# EAGLE design board (EAGLE 8.2.0)
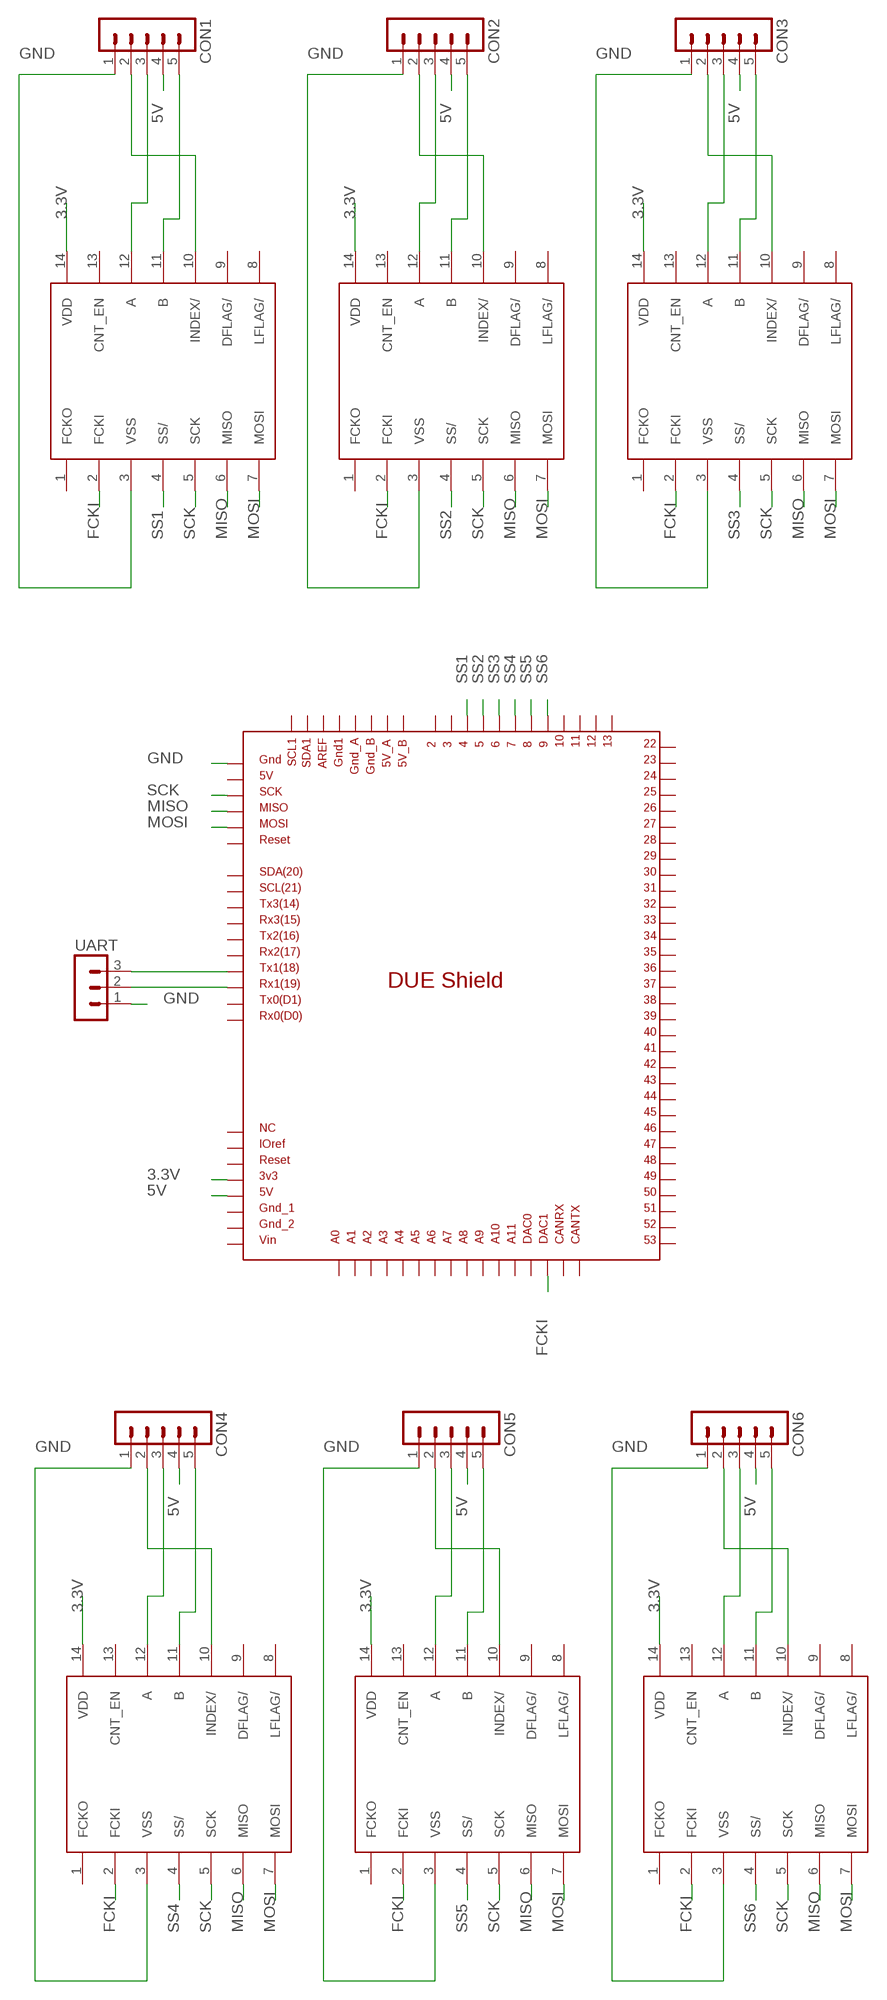
[diagram p0: schematic, sheet 1]

## Parts
CON1  MA05-1  [MA05-1]
CON2  MA05-1  [MA05-1]
CON3  MA05-1  [MA05-1]
CON4  MA05-1(BOTTOM)  [MA05-1(BOTTOM)]
CON5  MA05-1(BOTTOM)  [MA05-1(BOTTOM)]
CON6  MA05-1(BOTTOM)  [MA05-1(BOTTOM)]
IC1  LFLS7366R  [SO14]
IC2  LFLS7366R  [SO14]
IC3  LFLS7366R  [SO14]
IC4  LFLS7366R  [SO14]
IC5  LFLS7366R  [SO14]
IC6  LFLS7366R  [SO14]
U$1  DUE(ENCODER)  [DUE(ENCODER)]
UART  MA03-1  [MA03-1]

## Nets
3.3V [power]: IC1.14(VDD) IC2.14(VDD) IC3.14(VDD) IC4.14(VDD) IC5.14(VDD) IC6.14(VDD) U$1.3V3
5V [power]: CON1.4 CON2.4 CON3.4 CON4.4 CON5.4 CON6.4 U$1.5V
FCKI: IC1.2(FCKI) IC2.2(FCKI) IC3.2(FCKI) IC4.2(FCKI) IC5.2(FCKI) IC6.2(FCKI) U$1.DAC1
GND [power]: CON1.1 CON2.1 CON3.1 CON4.1 CON5.1 CON6.1 IC1.3(VSS) IC2.3(VSS) IC3.3(VSS) IC4.3(VSS) IC5.3(VSS) IC6.3(VSS) U$1.5V_ICSP UART.1
MISO: IC1.6(MISO) IC2.6(MISO) IC3.6(MISO) IC4.6(MISO) IC5.6(MISO) IC6.6(MISO) U$1.MISO_ICSP
MOSI: IC1.7(MOSI) IC2.7(MOSI) IC3.7(MOSI) IC4.7(MOSI) IC5.7(MOSI) IC6.7(MOSI) U$1.MOSI_ICSP
N$2: CON2.2 IC2.10(INDEX/)
N$3: U$1.TX1 UART.3
N$4: U$1.RX1 UART.2
N$5: CON2.3 IC2.12(A)
N$7: CON2.5 IC2.11(B)
N$8: CON3.2 IC3.10(INDEX/)
N$9: CON3.3 IC3.12(A)
N$10: CON3.5 IC3.11(B)
N$12: CON1.2 IC1.10(INDEX/)
N$13: CON1.3 IC1.12(A)
N$14: CON1.5 IC1.11(B)
N$16: CON5.2 IC5.10(INDEX/)
N$17: CON5.3 IC5.12(A)
N$18: CON5.5 IC5.11(B)
N$20: CON6.2 IC6.10(INDEX/)
N$21: CON6.3 IC6.12(A)
N$22: CON6.5 IC6.11(B)
N$24: CON4.2 IC4.10(INDEX/)
N$25: CON4.3 IC4.12(A)
N$26: CON4.5 IC4.11(B)
SCK: IC1.5(SCK) IC2.5(SCK) IC3.5(SCK) IC4.5(SCK) IC5.5(SCK) IC6.5(SCK) U$1.SCK_ICSP
SS1: IC1.4(SS/) U$1.4
SS2: IC2.4(SS/) U$1.5
SS3: IC3.4(SS/) U$1.6
SS4: IC4.4(SS/) U$1.7
SS5: IC5.4(SS/) U$1.8
SS6: IC6.4(SS/) U$1.9
Unconnected: IC1.1(FCKO) IC1.8(LFLAG/) IC1.9(DFLAG/) IC1.13(CNT_EN) IC2.1(FCKO) IC2.8(LFLAG/) IC2.9(DFLAG/) IC2.13(CNT_EN) IC3.1(FCKO) IC3.8(LFLAG/) IC3.9(DFLAG/) IC3.13(CNT_EN) IC4.1(FCKO) IC4.8(LFLAG/) IC4.9(DFLAG/) IC4.13(CNT_EN) IC5.1(FCKO) IC5.8(LFLAG/) IC5.9(DFLAG/) IC5.13(CNT_EN) IC6.1(FCKO) IC6.8(LFLAG/) IC6.9(DFLAG/) IC6.13(CNT_EN) U$1.2 U$1.3 U$1.5V_A U$1.5V_B U$1.10 U$1.11 U$1.12 U$1.13 U$1.22 U$1.23 U$1.24 U$1.25 U$1.26 U$1.27 U$1.28 U$1.29 U$1.30 U$1.31 U$1.32 U$1.33 U$1.34 U$1.35 U$1.36 U$1.37 U$1.38 U$1.39 U$1.40 U$1.41 U$1.42 U$1.43 U$1.44 U$1.45 U$1.46 U$1.47 U$1.48 U$1.49 U$1.50 U$1.51 U$1.52 U$1.53 U$1.A0 U$1.A1 U$1.A2 U$1.A3 U$1.A4 U$1.A5 U$1.A6 U$1.A7 U$1.A8 U$1.A9 U$1.A10 U$1.A11 U$1.AREF U$1.CANRX U$1.CANTX U$1.DAC0 U$1.GND1 U$1.GND_1 U$1.GND_2 U$1.GND_A U$1.GND_B U$1.GND_ICSP U$1.IOREF U$1.NC U$1.RESET U$1.RESET_ICSP U$1.RX0 U$1.RX2 U$1.RX3 U$1.SCL U$1.SCL1 U$1.SDA U$1.SDA1 U$1.TX0 U$1.TX2 U$1.TX3 U$1.VIN

## Library data of the parts
CON1-CON3 = encoder_project:MA05-1: PIN HEADER; OC_FARNELL: unknown; OC_NEWARK: unknown
CON4-CON6 = encoder_project:MA05-1(BOTTOM): PIN HEADER
IC1-IC6 = encoder_project:LFLS7366R
U$1 = DUElib130425:DUE(ENCODER)
UART = encoder_project:MA03-1: PIN HEADER; OC_FARNELL: unknown; OC_NEWARK: unknown

## Net classes
0 default: width 0.254 mm, drill 0.457 mm, clearance 0.381 mm
1 power: width 0.762 mm, drill 0.457 mm, clearance 0.254 mm

## Board
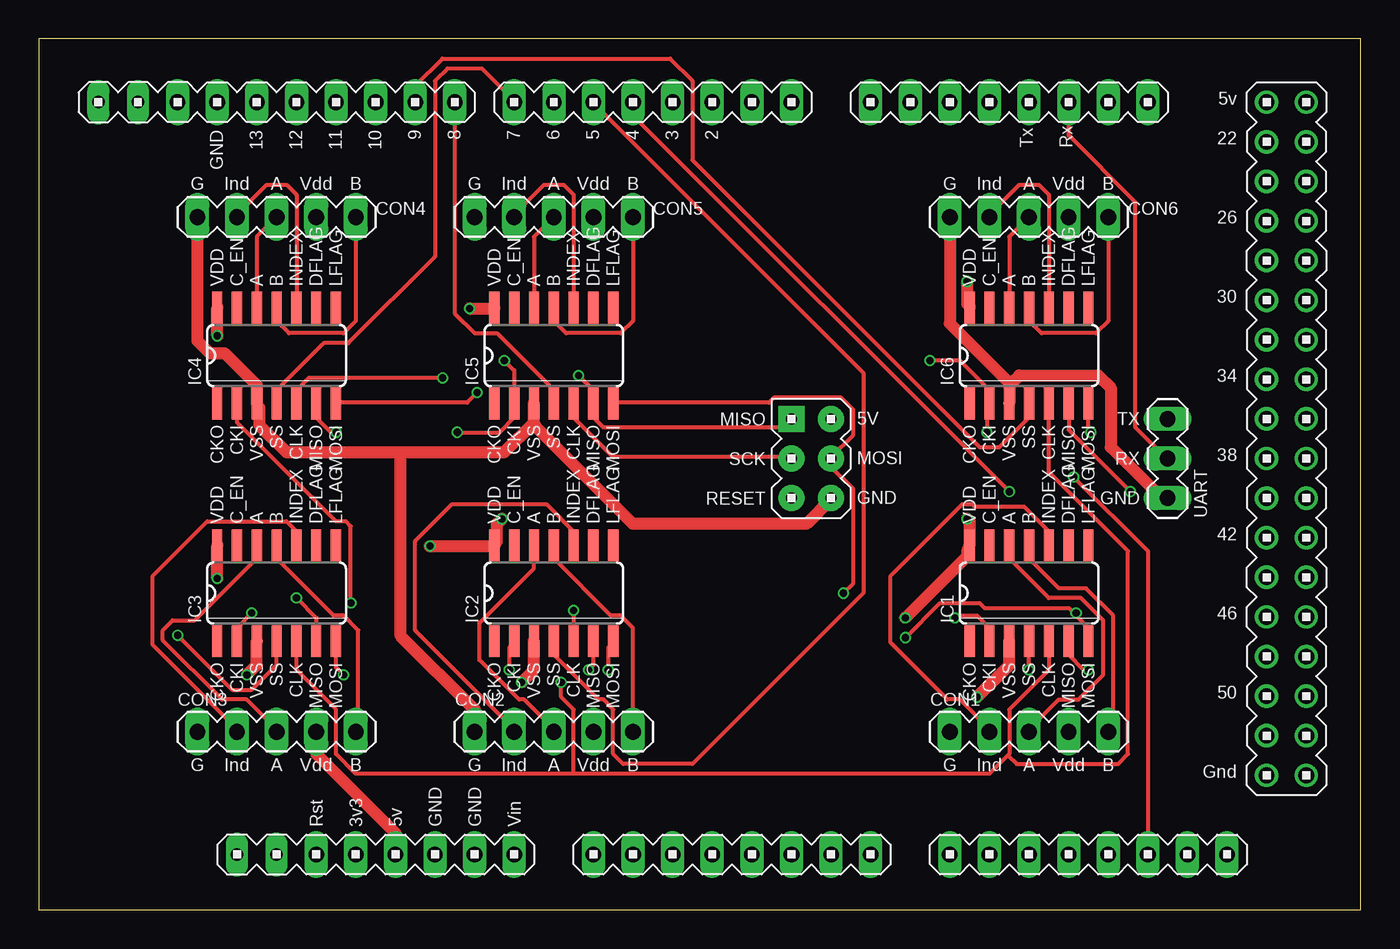
[diagram p1: board, top side]
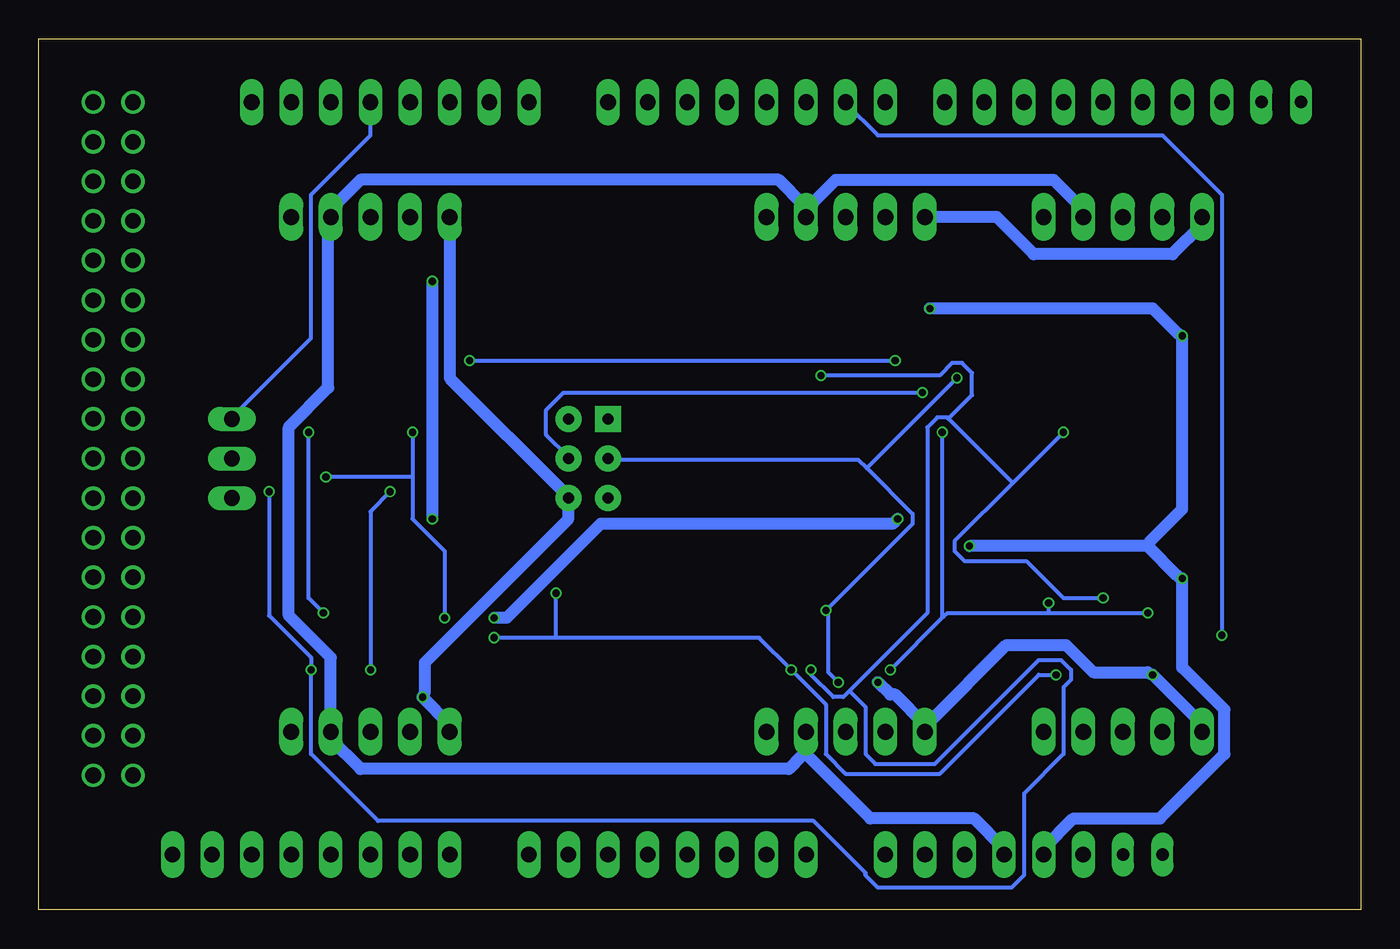
[diagram p2: board, bottom side, seen from below]

Size 84.76 x 55.87 mm. Coordinates in mm from the lower left corner, seen from the top.
Outline: 0,0 84.76,0 84.76,55.87 0,55.87 0,0
Copper layers (1*16): Top 0.035559375mm / dielectric 1.6mm / Bottom 0.035559375mm
Design rules "oshpark-2layer": minimum track width 6mil, minimum drill 10mil, track to track 6mil, track to pad 6mil, pad to pad 6mil, via to via 6mil, smd to smd 6mil, copper to edge 15mil, drill to drill 6mil, minimum pad ring 5mil, minimum via ring 5mil, stop-mask expansion 2.5mil, vias tented up to drill 0mil, thermal gap 10mil

### Footprints (pad centres in the part's own frame; a part is rotated, then mirrored left to right if it is on the bottom)
MA05-1 = drill 1.016 long: 1 -5.08,0; 2 -2.54,0; 3 0,0; 4 2.54,0; 5 5.08,0
MA05-1(BOTTOM) = drill 1.016 long: 1 -5.08,0; 2 -2.54,0; 3 0,0; 4 2.54,0; 5 5.08,0
SO14 = smd 0.66 x 2.032: 1 -3.81,-3.073; 2 -2.54,-3.073; 3 -1.27,-3.073; 4 0,-3.073; 5 1.27,-3.073; 6 2.54,-3.073; 7 3.81,-3.073; 8 3.81,3.073; 9 2.54,3.073; 10 1.27,3.073; 11 0,3.073; 12 -1.27,3.073; 13 -2.54,3.073; 14 -3.81,3.073
DUE(ENCODER) = drill 1 long: 2 -16.51,30.48; 3 -19.05,30.48; 3V3 -39.37,-17.78; 4 -21.59,30.48; 5 -24.13,30.48; 5V -36.83,-17.78; 6 -26.67,30.48; 7 -29.21,30.48; 8 -33.02,30.48; 9 -35.56,30.48; 10 -38.1,30.48; 11 -40.64,30.48; 12 -43.18,30.48; 13 -45.72,30.48; A0 -24.13,-17.78; A1 -21.59,-17.78; A2 -19.05,-17.78; A3 -16.51,-17.78; A4 -13.97,-17.78; A5 -11.43,-17.78; A6 -8.89,-17.78; A7 -6.35,-17.78; A8 -1.27,-17.78; A9 1.27,-17.78; A10 3.81,-17.78; A11 6.35,-17.78; AREF -50.8,30.48; AREF1 -50.8,30.48; CANRX 13.97,-17.78; CANTX 16.51,-17.78; DAC0 8.89,-17.78; DAC1 11.43,-17.78; GND1 -48.26,30.48; GND_1 -34.29,-17.78; GND_2 -31.75,-17.78; RESET -41.91,-17.78; RX0 -11.43,30.48; RX1 6.35,30.48; RX2 1.27,30.48; RX3 -3.81,30.48; SCL 11.43,30.48; SDA 8.89,30.48; TX0 -13.97,30.48; TX1 3.81,30.48; TX2 -1.27,30.48; TX3 -6.35,30.48; VIN -29.21,-17.78 | drill 1: 5V_A 19.05,30.48; 5V_B 21.59,30.48; 22 19.05,27.94; 23 21.59,27.94; 24 19.05,25.4; 25 21.59,25.4; 26 19.05,22.86; 27 21.59,22.86; 28 19.05,20.32; 29 21.59,20.32; 30 19.05,17.78; 31 21.59,17.78; 32 19.05,15.24; 33 21.59,15.24; 34 19.05,12.7; 35 21.59,12.7; 36 19.05,10.16; 37 21.59,10.16; 38 19.05,7.62; 39 21.59,7.62; 40 19.05,5.08; 41 21.59,5.08; 42 19.05,2.54; 43 21.59,2.54; 44 19.05,0; 45 21.59,0; 46 19.05,-2.54; 47 21.59,-2.54; 48 19.05,-5.08; 49 21.59,-5.08; 50 19.05,-7.62; 51 21.59,-7.62; 52 19.05,-10.16; 53 21.59,-10.16; GND_A 19.05,-12.7; GND_B 21.59,-12.7 | drill 0.7 pad 1.676: 5V_ICSP -8.89,5.08; GND_ICSP -8.89,10.16; MOSI_ICSP -8.89,7.62; RESET_ICSP -11.43,5.08; SCK_ICSP -11.43,7.62 | drill 0.8 pad 1.422 long: IOREF -44.45,-17.78; NC -46.99,-17.78; SCL1 -55.88,30.48; SDA1 -53.34,30.48 | drill 0.7 pad 1.676 square: MISO_ICSP -11.43,10.16
MA03-1 = drill 1.016 long: 1 -2.54,0; 2 0,0; 3 2.54,0

### Placement (x,y rotation side)
CON1  63.5,11.43 0 top
CON2  33.02,11.43 0 top
CON3  15.24,11.43 0 top
CON4  15.24,44.45 0 top
CON5  33.02,44.45 0 top
CON6  63.5,44.45 0 top
IC1  63.5,20.32 0 top
IC2  33.02,20.32 0 top
IC3  15.24,20.32 0 top
IC4  15.24,35.56 0 top
IC5  33.02,35.56 0 top
IC6  63.5,35.56 0 top
U$1  59.69,21.34 0 top
UART  72.39,28.96 90 top

### Tracks (layer width: path | path; a pad name or v marks a point on that pad's centre or on a via)
3.3V  (via drill 0.46)
  Top 0.762: v59.53,25.08 59.69,24.92 IC1.14 59.53,23.02 59.53,22.7 v55.56,18.73 | v59.53,40.32 59.53,38.89 59.69,38.73 IC6.14 | v11.43,21.27 IC3.14 | v25.08,23.34 29.21,23.34 IC2.14 29.37,23.65 29.37,24.77 v29.69,25.08 | v11.43,36.83 IC4.14 | v27.62,38.58 29.21,38.58 IC5.14
  Bottom 0.762: v59.53,40.32 v59.53,25.08 | U$1.3V3 20.32,3.97 18.41,5.87 12.86,5.87 8.73,10 8.73,12.86 11.43,15.56 v11.43,21.27 11.75,21.43 13.65,23.34 | 13.65,23.34 v25.08,23.34 | 13.65,23.34 13.49,23.65 11.43,25.72 v11.43,36.83 11.75,36.99 13.34,38.58 v27.62,38.58 | v55.56,18.73 54.77,18.73 48.74,24.77 30,24.77 v29.69,25.08
5V
  Top 0.762: U$1.5V 22.86,4.92 17.78,10 CON3.4
  Bottom 0.762: CON4.4 17.78,44.93 19.68,46.83 33.66,46.83 35.56,44.93 CON5.4 35.72,45.24 37.31,46.83 64.14,46.83 66.04,44.93 CON6.4 66.2,44.13 66.2,33.5 68.74,30.96 68.74,18.89 66.04,16.19 CON1.4 66.04,10.95 64.14,9.05 36.67,9.05 35.88,9.84 35.56,10 | 35.56,10 CON2.4 | 35.56,10 31.43,5.87 24.77,5.87 22.86,3.97 U$1.5V
FCKI  (via drill 0.46)
  Top 0.254: IC3.2 12.7,18.1 v13.65,19.05 | v30.16,15.4 30.16,16.83 30.48,17.14 IC2.2 | IC4.2 12.7,31.27 19.05,24.92 19.68,24.92 20,24.61 v20,19.68 | v26.83,30.64 29.53,30.64 30.48,31.59 IC5.2 30.48,34.61 v29.84,35.24 | IC1.2 60.96,18.1 60.17,18.89 58.9,18.89 v58.74,18.73 | v60.8,30.64 60.8,32.23 60.96,32.38 IC6.2 60.96,33.34 59.05,35.24 v57.15,35.24 | U$1.DAC1 71.12,23.02 v66.36,27.78
  Bottom 0.254: 20,19.05 26.51,19.05 26.75,18.81 | 20,19.05 v13.65,19.05 | v30.16,15.4 26.75,18.81 | 20,19.05 v20,19.68 | v26.83,30.64 26.83,18.89 26.75,18.81 | v58.74,18.73 58.74,23.02 60.8,25.08 60.8,27.78 | v60.8,30.64 60.8,27.78 | 60.8,27.78 v66.36,27.78 | v57.15,35.24 v29.84,35.24
GND  (via drill 0.46)
  Top 0.762: IC3.3 13.97,15.72 v13.34,15.08 | IC2.3 31.75,15.4 v30.96,14.61 | CON4.1 10.16,36.51 10.95,35.72 11.91,35.72 13.97,33.66 IC4.3 14.13,32.23 14.13,31.11 15.88,29.37 23.18,29.37 | 31.75,31.27 IC5.3 | 31.75,31.27 29.84,29.37 23.18,29.37 | CON2.1 27.94,12.86 23.18,17.62 23.18,29.37 | IC1.3 62.23,15.72 v60.17,13.65 | 62.23,33.81 IC6.3 | 62.23,33.81 58.42,37.62 CON6.1 | UART.1 72.39,26.51 71.91,26.51 68.74,29.69 68.74,33.5 67.94,34.29 62.87,34.29 62.55,33.97 62.23,33.81 | 31.75,31.27 31.91,30.96 38.1,24.77 49.21,24.77 50.8,26.35 U$1.5V_ICSP
  Bottom 0.762: CON3.1 10.16,11.91 v13.34,15.08 13.65,15.24 17.14,15.24 18.89,16.99 22.7,16.99 27.62,12.06 CON2.1 27.94,11.91 29.84,13.81 30.16,13.81 v30.96,14.61 | CON5.1 23.34,44.45 20.95,42.07 12.06,42.07 10.16,43.97 CON4.1 | CON1.1 58.42,11.91 v60.17,13.65 60.01,13.97 60.01,15.88 50.8,25.08 U$1.5V_ICSP 50.96,26.67 58.42,34.13 CON6.1
MISO  (via drill 0.46)
  Top 0.254: IC1.6 66.04,16.35 66.99,15.4 v67.31,15.4 | v70.01,26.83 66.04,30.8 IC6.6 | U$1.MISO_ICSP 48.26,31.43 47.78,30.96 36.2,30.96 35.56,31.59 IC5.6 35.56,33.34 v34.61,34.29 | IC3.6 17.78,18.73 v16.51,20 | v19.05,30.64 18.73,30.64 17.78,31.59 IC4.6 | IC2.6 35.56,15.72 v35.24,15.4
  Bottom 0.254: v70.01,26.83 70.01,18.89 67.31,16.19 v67.31,15.4 67.31,10 63.02,5.71 35.08,5.71 31.75,2.38 31.75,2.22 30.96,1.43 22.38,1.43 21.59,2.22 21.59,7.46 19.05,10 19.05,14.29 18.57,14.76 18.57,15.4 19.21,16.03 20.64,16.03 27.3,9.37 31.11,9.37 31.75,10 31.75,13.02 32.78,14.05 | v16.51,20 19.05,20 21.43,22.38 25.4,22.38 26.04,23.02 26.04,23.65 22.3,27.38 | v19.05,30.64 22.3,27.38 | v35.24,15.4 35.24,15.08 33.81,13.65 33.18,13.65 32.78,14.05 | 32.78,14.05 27.78,19.05 27.78,30.96 27.15,31.59 26.51,31.59 26.43,31.51 | 22.3,27.38 26.43,31.51 | v34.61,34.29 26.99,34.29 26.19,35.08 25.56,35.08 24.92,34.45 24.92,33.02 26.43,31.51
MOSI  (via drill 0.46)
  Top 0.254: v28.1,33.18 27.46,32.54 19.05,32.54 IC4.7 | IC5.7 36.83,32.54 46.83,32.54 47.15,32.86 51.44,32.86 52.23,32.07 52.23,30.48 50.8,29.05 U$1.MOSI_ICSP 50.8,28.42 52.23,26.99 52.23,20.95 v51.59,20.32 | IC3.7 19.05,15.56 v19.53,15.08 | v36.51,15.4 36.51,16.83 36.83,17.14 IC2.7 | IC1.7 67.31,18.1 66.44,18.97 | 66.44,18.97 66.04,19.37 60.64,19.37 60.33,19.68 57.78,19.68 v55.56,17.46 | IC6.7 67.31,30.8 v67.47,30.64 | v66.52,19.05 66.44,18.97
  Bottom 0.254: v28.1,33.18 51.12,33.18 52.23,32.07 52.23,30.48 50.8,29.05 U$1.MOSI_ICSP | v19.53,15.08 20.64,15.08 26.99,8.73 33.02,8.73 34.29,10 34.29,13.18 v36.51,15.4 38.58,17.46 51.59,17.46 | 51.59,17.46 v55.56,17.46 | v67.47,30.64 67.47,20 v66.52,19.05 | 51.59,17.46 v51.59,20.32
N$2
  Top 0.254: IC2.10 34.29,24.29 32.54,26.04 26.51,26.04 24.13,23.65 24.13,17.94 30.48,11.59 CON2.2
N$3
  Bottom 0.254: U$1.TX1 63.5,49.69 67.31,45.88 67.31,36.67 72.39,31.59 UART.3
N$4
  Top 0.254: U$1.RX1 66.04,49.69 70.33,45.4 70.33,30.96 72.39,28.89 UART.2
N$5
  Top 0.254: IC2.12 31.75,21.91 28.26,18.41 28.26,16.03 30.8,13.49 31.11,13.49 33.02,11.59 CON2.3
N$7
  Top 0.254: IC2.11 33.02,22.54 36.67,18.89 37.31,18.89 38.1,18.1 CON2.5
N$8
  Top 0.254: IC3.10 16.51,24.29 15.88,24.92 10.79,24.92 7.3,21.43 7.3,16.99 12.7,11.59 CON3.2
N$9
  Top 0.254: IC3.12 13.97,22.54 10,18.57 8.57,18.57 7.94,17.94 7.94,17.3 11.75,13.49 13.34,13.49 15.24,11.59 CON3.3
N$10
  Top 0.254: IC3.11 15.24,22.54 18.89,18.89 19.53,18.89 20.48,17.94 20.48,11.59 CON3.5
N$12
  Top 0.254: IC1.10 64.77,24.29 63.18,25.88 60.01,25.88 59.85,26.04 59.21,26.04 54.61,21.43 54.61,17.14 58.26,13.49 59.05,13.49 60.96,11.59 CON1.2
N$13
  Top 0.254: IC1.12 62.23,22.54 64.77,20 66.83,20 68.26,18.57 68.26,15.08 66.67,13.49 65.41,13.49 63.5,11.59 CON1.3
N$14
  Top 0.254: IC1.11 63.5,22.54 65.41,20.64 67.15,20.64 68.9,18.89 68.9,11.75 CON1.5
N$16
  Top 0.254: IC5.10 34.29,45.88 33.66,46.51 32.38,46.51 30.48,44.61 CON5.2
N$17
  Top 0.254: IC5.12 31.75,43.18 CON5.3
N$18
  Top 0.254: IC5.11 33.02,37.78 33.81,36.99 37.31,36.99 38.1,37.78 CON5.5
N$20
  Top 0.254: IC6.10 64.77,45.88 64.14,46.51 62.87,46.51 60.96,44.61 CON6.2
N$21
  Top 0.254: IC6.12 62.23,43.18 CON6.3
N$22
  Top 0.254: IC6.11 63.5,37.78 64.29,36.99 67.79,36.99 68.58,37.78 CON6.5
N$24
  Top 0.254: IC4.10 16.51,45.88 15.88,46.51 14.61,46.51 12.7,44.61 CON4.2
N$25
  Top 0.254: IC4.12 13.97,43.18 CON4.3
N$26
  Top 0.254: IC4.11 15.24,37.78 16.03,36.99 19.53,36.99 20.32,37.78 CON4.5
SCK  (via drill 0.46)
  Top 0.254: v34.29,19.21 IC2.5 | IC4.5 16.51,33.34 17.3,34.13 v25.88,34.13 | IC5.5 34.29,31.59 36.83,29.05 48.26,29.05 U$1.SCK_ICSP | IC3.5 16.51,15.4 19.05,12.86 19.05,10 20.32,8.73 34.29,8.73 | 34.29,8.73 60.96,8.73 62.15,9.92 | 62.15,9.92 62.23,10 62.23,12.86 64.77,15.4 IC1.5 | IC6.5 64.77,28.1 69.85,23.02 69.85,10 69.22,9.37 62.71,9.37 62.15,9.92 | v33.5,14.61 33.5,13.65 34.29,12.86 34.29,8.73
  Bottom 0.254: 31.67,28.34 32.23,28.89 48.26,28.89 U$1.SCK_ICSP | 31.67,28.34 28.73,25.4 28.73,24.77 v34.29,19.21 34.13,19.21 34.13,15.24 v33.5,14.61 | 31.67,28.34 v25.88,34.13
SS1  (via drill 0.46)
  Top 0.254: v63.5,15.4 IC1.4 | v62.23,26.83 38.1,50.96 U$1.4
  Bottom 0.254: v63.5,15.4 63.5,25.56 v62.23,26.83
SS2
  Top 0.254: IC2.4 33.02,16.35 35.88,13.49 36.2,13.49 36.83,12.86 36.83,10 37.47,9.37 41.91,9.37 52.86,20.32 52.86,34.45 35.56,51.75 U$1.5
SS3  (via drill 0.46)
  Top 0.254: IC3.4 15.24,15.72 13.65,14.13 12.38,14.13 v8.89,17.62
  Bottom 0.254: v8.89,17.62 8.89,45.88 12.7,49.69 30.96,49.69 33.02,51.75 U$1.6
SS4
  Top 0.254: IC4.4 15.24,33.34 18.26,36.35 19.84,36.35 25.4,41.91 25.4,53.18 26.19,53.98 28.42,53.98 30.48,51.91 U$1.7
SS5
  Top 0.254: IC5.4 33.02,33.34 29.37,36.99 27.94,36.99 26.67,38.26 U$1.8
SS6
  Top 0.254: IC6.4 63.5,31.59 61.59,29.69 60.33,29.69 41.91,48.1 41.91,53.18 40.48,54.61 25.88,54.61 24.13,52.86 U$1.9